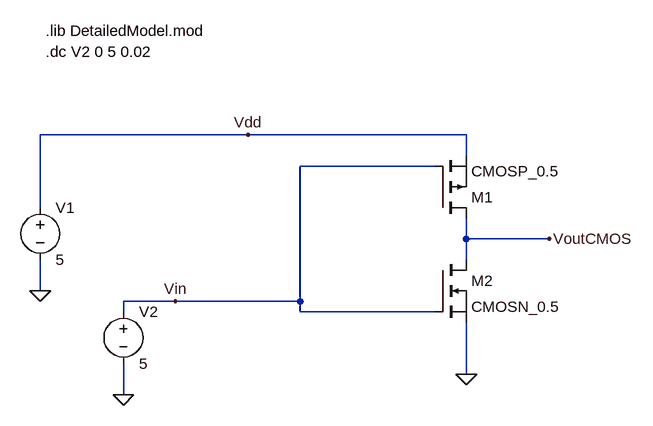
[diagram p0: schematic cmos_inverter.asc]
cmos_inverter.asc, the LTspice schematic file:
Version 4
SHEET 1 880 680
WIRE 112 -16 -208 -16
WIRE 448 -16 112 -16
WIRE 448 16 448 -16
WIRE 400 32 192 32
WIRE -208 96 -208 -16
WIRE 448 144 448 112
WIRE 576 144 448 144
WIRE 448 176 448 144
WIRE -208 224 -208 176
WIRE 0 240 -80 240
WIRE 192 240 192 32
WIRE 192 240 0 240
WIRE -80 256 -80 240
WIRE 192 256 192 240
WIRE 400 256 192 256
WIRE 448 352 448 272
WIRE -80 384 -80 336
FLAG -208 224 0
FLAG -80 384 0
FLAG 448 352 0
FLAG 112 -16 Vdd
FLAG 0 240 Vin
FLAG 576 144 VoutCMOS
SYMBOL voltage -208 80 R0
SYMATTR InstName V1
SYMATTR Value 5
SYMBOL pmos 400 112 M180
SYMATTR InstName M1
SYMATTR Value CMOSP_0.5
SYMBOL nmos 400 176 R0
SYMATTR InstName M2
SYMATTR Value CMOSN_0.5
SYMBOL voltage -80 240 R0
WINDOW 123 0 0 Left 0
WINDOW 39 0 0 Left 0
SYMATTR InstName V2
SYMATTR Value 5
TEXT -200 -176 Left 2 !.lib DetailedModel.mod
TEXT -200 -144 Left 2 !.dc V2 0 5 0.02

The netlist it stands for:
* cmos_inverter.asc
V1 Vdd 0 5
M1 VoutCMOS Vin Vdd Vdd CMOSP_0.5
M2 VoutCMOS Vin 0 0 CMOSN_0.5
V2 Vin 0 5
.model NMOS NMOS
.model PMOS PMOS
.lib standard.mos
.lib DetailedModel.mod
.dc V2 0 5 0.02
.backanno
.end

* Results of the author's LTspice run, read from the files saved beside the schematic
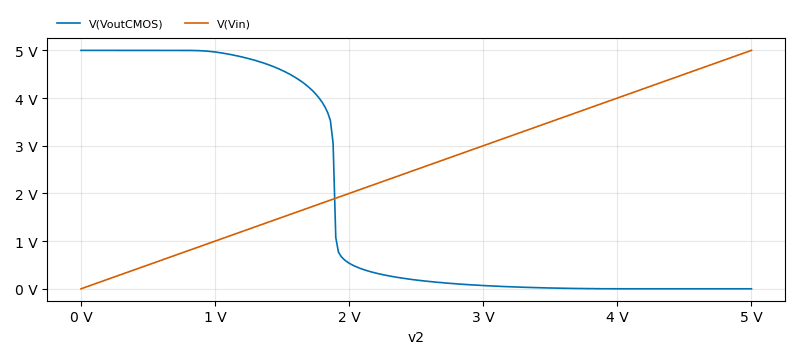
[diagram p1: DC transfer characteristic of cmos_inverter.asc, plotted from the saved traces]
* DC transfer characteristic, 1 run:
*   V(VoutCMOS): 5 V at v2=0 V, 15.84 nV at v2=5 V, min 15.84 nV, max 5 V
*   V(Vin): 0 V at v2=0 V, 5 V at v2=5 V, min 0 V, max 5 V